# EAGLE design hipwr-tvbnull (EAGLE 5.11)
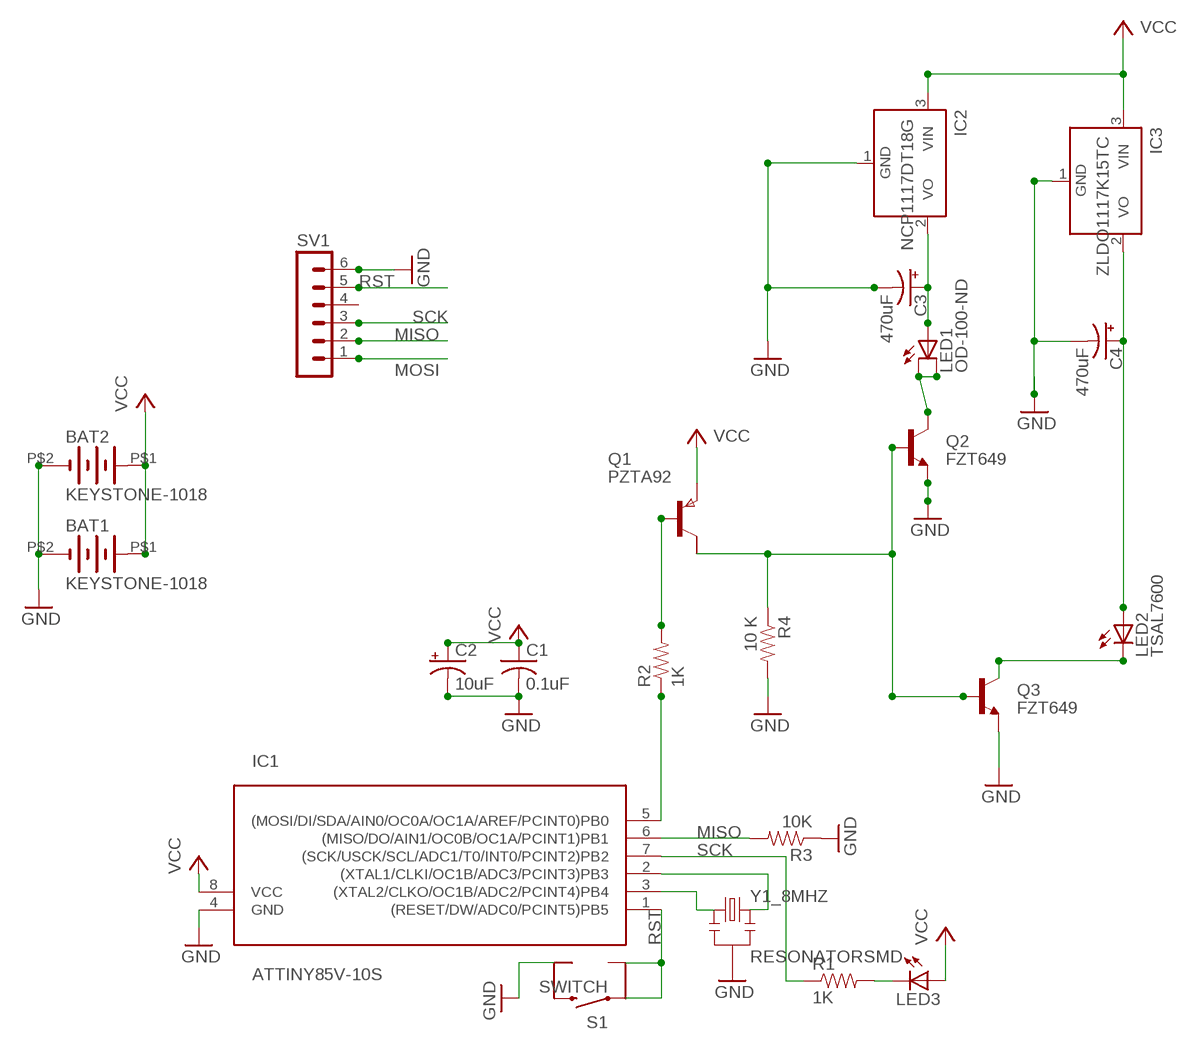
[diagram p0: schematic, sheet 1]

## Parts
BAT1  KEYSTONE-1018  [KEYSTONE-CR123A-SMT]
BAT2  KEYSTONE-1018  [KEYSTONE-CR123A-SMT]
C1  0.1uF  C-USC0805K  [C0805K]
C2  10uF  CAP_POL1206  [EIA3216]
C3  470uF  CAP_POL7343  [EIA7343]
C4  470uF  CAP_POL7343  [EIA7343]
IC1  ATTINY85V-10S  [SOIC8]
IC2  NCP1117DT18G  NCP1117  [TO252-DES]
IC3  ZLDO1117K15TC  NCP1117  [TO252-DES]
LED1  OD-100-ND  OD-100  [OD-100]
LED2  TSAL7600  SFH482  [SFH482]
LED3  LEDCHIPLED_1206  [CHIPLED_1206]
Q1  PZTA92  FZT789A  [SOT223]
Q2  FZT649  TRANSISTOR_NPN  [SOT223]
Q3  FZT649  TRANSISTOR_NPN  [SOT223]
R1  1K  RESISTOR1206  [1206]
R2  1K  RESISTOR1206  [1206]
R3  10K  RESISTOR  [0805]
R4  10 K  RESISTOR  [0805]
S1  SWITCH  SWITCH-MOMENTARY-2SMD  [TACTILE_SWITCH_SMD]
SV1  CON-LSTB_MA06-1  [CON-LSTB_MA06-1]
Y1_8MHZ  RESONATORSMD  [RESONATOR-SMD]

## Nets
GND: BAT1.P$2(-) BAT2.P$2(-) C1.2 C2.C(-) C3.C(-) C4.C(-) IC1.4(GND) IC2.1(GND) IC3.1(GND) Q2.3(E) Q3.3(E) R3.1 R4.2 S1.4 SV1.6 Y1_8MHZ.2
MISO: IC1.6((MISO/DO/AIN1/OC0B/OC1A/PCINT1)PB1) R3.2 SV1.2
MOSI: IC1.5((MOSI/DI/SDA/AIN0/OC0A/OC1A/AREF/PCINT0)PB0) R2.1 SV1.1
N$1: IC1.3((XTAL2/CLKO/OC1B/ADC2/PCINT4)PB4) Y1_8MHZ.1
N$2: IC1.2((XTAL1/CLKI/OC1B/ADC3/PCINT3)PB3) Y1_8MHZ.3
N$3: LED3.C R1.2
N$4: C3.A(+) IC2.2(VO) LED1.ANODE(A)
N$5: LED2.K(C) Q3.2(C)
N$6: Q1.1(B) R2.2
N$7: Q1.4(C1) Q2.1(B) Q3.1(B) R4.1
N$8: LED1.CATHODE2(C1) LED1.CATHODE(C) Q2.2(C)
N$9: C4.A(+) IC3.2(VO) LED2.A
RST: IC1.1((RESET/DW/ADC0/PCINT5)PB5) S1.1 S1.2 SV1.5
SCK: IC1.7((SCK/USCK/SCL/ADC1/T0/INT0/PCINT2)PB2) R1.1 SV1.3
VCC: BAT1.P$1(+) BAT2.P$1(+) C1.1 C2.A(+) IC1.8(VCC) IC2.3(VIN) IC3.3(VIN) LED3.A Q1.3(E)
Unconnected: Q1.2(C) S1.3 SV1.4

## Library data of the parts
BAT1 BAT2 = eagle-library-edeca.net-v4:KEYSTONE-1018
C1 = rcl-ez:C-US: CAPACITOR, American symbol
C2-C4 = SparkFun:CAP_POL: Capacitor Polarized These are standard SMD and PTH capacitors. Normally 10uF, 47uF, and 100uF in electrolytic and tantalum varieties. Always verify the external diameter of the through hole cap, it varies with capacity, voltage, and manufacturer. The EIA devices should be standard.
IC1 = avr:ATTINY85: MICROCONTROLLER 8 Kbytes FLASH 512 bytes EEPROM 512 bytes RAM 4-channel 10 bit ADC USI
IC2 IC3 = national-semiconductor:NCP1117
LED1 = led:OD-100
LED2 = led:SFH482: IR LED infrared emitting diode, Infineon
LED3 = minimidi:LED: LED OSRAM: - CHIPLED LG R971, LG N971, LY N971, LG Q971, LY Q971, LO R971, LY R971 LH N974, LH R974 LS Q976, LO Q976, LY Q976 LO Q996 - Hyper CHIPLED LW Q18S LB Q993, LB Q99A, LB R99A - SideLED LS A670, LO A670, LY A670, LG A670, LP A670 LB A673, LV A673, LT A673, LW A673 LH A674 LY A675 LS A676, LA A676, LO A676, LY A676, LW A676 LS A679, LY A679, LG A679 - Hyper Micro SIDELED® LS Y876, LA Y876, LO Y876, LY Y876 LT Y87S - SmartLED LW L88C, LW L88S LB L89C, LB L89S, LG L890 LS L89K, LO L89K, LY L89K LS L896, LA L896, LO L896, LY L896 - TOPLED LS T670, LO T670, LY T670, LG T670, LP T670 LSG T670, LSP T670, LSY T670, LOP T670, LYG T670 LG T671, LOG T671, LSG T671 LB T673, LV T673, LT T673, LW T673 LH T674 LS T676, LA T676, LO T676, LY T676, LB T676, LH T676, LSB T676, LW T676 LB T67C, LV T67C, LT T67C, LS T67K, LO T67K, LY T67K, LW E67C LS E67B, LA E67B, LO E67B, LY E67B, LB E67C, LV E67C, LT E67C LW T67C LS T679, LY T679, LG T679 LS T770, LO T770, LY T770, LG T770, LP T770 LB T773, LV T773, LT T773, LW T773 LH T774 LS E675, LA E675, LY E675, LS T675 LS T776, LA T776, LO T776, LY T776, LB T776 LHGB T686 LT T68C, LB T68C - Hyper Mini TOPLED® LB M676 - Mini TOPLED Santana® LG M470 LS M47K, LO M47K, LY M47K Source: http://www.osram.convergy.de/
Q1 = zetex:FZT789A: PNP TRANSISTOR; MPN: FZT789A; OC_FARNELL: 9526633; OC_NEWARK: 97K0407
Q2 Q3 = SparkFun:TRANSISTOR_NPN: Transistor NPN BJT configuration in SOT23 package. MMBT2222 is the common NPN we use. Double check BCE configuration again layout.
R1-R4 = SparkFun:RESISTOR: Resistor Basic schematic elements and footprints for 0603, 1206, and PTH 1/10th watt (small) resistors.
S1 = SparkFun:SWITCH-MOMENTARY-2
SV1 = NSL:CON-LSTB_MA06-1: PIN HEADER
Y1_8MHZ = SparkFun:RESONATOR: Resonator Small SMD resonator. This is the itty bitty 10/20MHz resonators with built in caps. CSTCE10M0G55 and CSTCE20M0V53. Footprint has been reviewed closely but hasn't been tested yet.

## Board
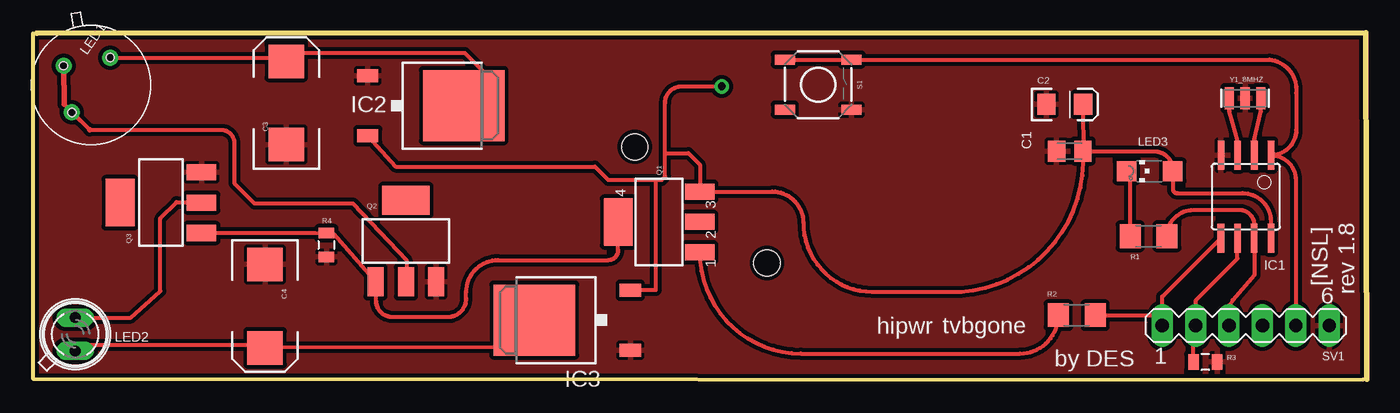
[diagram p1: board, top side]
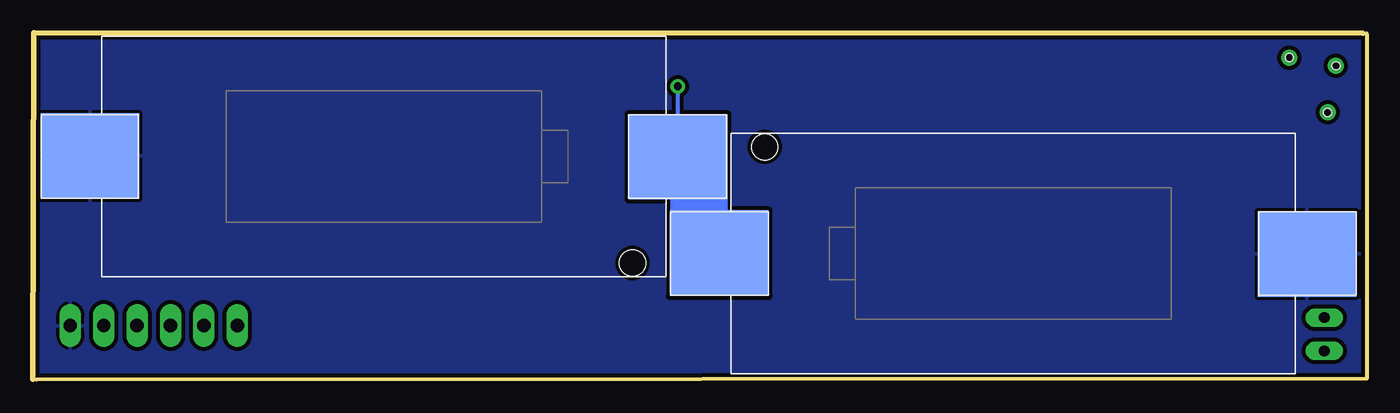
[diagram p2: board, bottom side, seen from below]

Size 101.45 x 26.37 mm. Coordinates in mm from the lower left corner, seen from the top.
Outline: 0.31,26.34 101.4,26.37 101.45,0.03
Outline: 0,26.31 0,0.08 101.17,0
Copper layers (1*16): Top 0.0356mm / dielectric 1.5011mm / Bottom 0.0356mm
Design rules "SparkFun-mod": minimum track width 8mil, minimum drill 20mil, track to track 12mil, track to pad 12mil, pad to pad 8mil, via to via 8mil, smd to smd 8mil, copper to edge 12mil, drill to drill 8mil, minimum pad ring 12mil, minimum via ring 10mil, stop-mask expansion 4mil, vias tented up to drill 25mil, thermal gap 10mil

### Footprints (pad centres in the part's own frame; a part is rotated, then mirrored left to right if it is on the bottom)
KEYSTONE-CR123A-SMT = smd 6.5 x 7.5: P$1 0.02,22.37; P$2 -0.04,-22.34 | hole 2: 8.1,18.915
C0805K = smd 1.3 x 1.6: 1 -1,0; 2 1,0
EIA3216 = smd 1.4 x 1.6: A 1.4,0; C -1.4,0
EIA7343 = smd 2.55 x 2.7: A 3.17,0; C -3.17,0
SOIC8 = smd 0.5 x 2.2: 1 -1.905,-3.154; 2 -0.645,-3.154; 3 0.625,-3.154; 4 1.895,-3.154; 5 1.905,3.154; 6 0.635,3.154; 7 -0.635,3.154; 8 -1.905,3.154
TO252-DES = smd 1 x 1.6: 1 -2.28,-4.8; 3 2.28,-4.8 | smd 5.4 x 6.2: 2 0,2.5
OD-100 = drill 0.61 round: ANODE 0,2.54; CATHODE -2.54,0; CATHODE2 0,-2.54 | hole 0.61: 0,-2.54; -2.54,0; 0,2.54
SFH482 = drill 0.813 long: A -1.27,0; K 1.27,0
CHIPLED_1206 = smd 1.5 x 1.5: A 0,-1.75; C 0,1.75
SOT223 = smd 1.219 x 2.235: 1 -2.311,-3.099; 2 0,-3.099; 3 2.311,-3.099 | smd 3.6 x 2.2: 4 0,3.099
1206 = smd 1.6 x 1.8: 1 -1.4,0; 2 1.4,0
0805 = smd 0.8 x 1.2: 1 -0.9,0; 2 0.9,0
TACTILE_SWITCH_SMD = smd 1.524 x 0.762: 1 -2.54,1.905; 2 2.54,1.905; 3 -2.54,-1.905; 4 2.54,-1.905
CON-LSTB_MA06-1 = drill 1.016 long: 1 -6.35,0; 2 -3.81,0; 3 -1.27,0; 4 1.27,0; 5 3.81,0; 6 6.35,0
RESONATOR-SMD = smd 0.7 x 1.7: 1 -1.2,0; 2 0,0; 3 1.2,0

### Placement (x,y rotation side)
BAT1  74.75,16.97 270 bottom
BAT2  26.87,9.6 90 bottom
C1  78.87,17.37 180 top
C2  78.49,20.93 0 top
C3  19.28,21.03 90 top
C4  17.65,5.59 270 top
IC1  92.26,13.91 180 top
IC2  30.28,20.83 270 top
IC3  40.64,4.52 90 top
LED1  4.42,22.4 325 top
LED2  3.23,3.45 90 top
LED3  84.94,15.85 90 top
Q1  47.62,11.99 90 top
Q2  28.37,10.54 0 top
Q3  9.73,13.46 90 top
R1  84.86,10.9 180 top
R2  79.4,4.9 180 top
R3  89.18,1.35 180 top
R4  22.33,10.24 270 top
S1  59.73,22.43 0 top
SV1  92.25,4.11 0 top
Y1_8MHZ  92.2,21.39 0 top

### Tracks (layer width: path | path; a pad name or v marks a point on that pad's centre or on a via)
GND
  pour Top: 0,2.06 0.03,26.42 101.4,26.34 101.47,-0.03 0.03,0.05
  pour Bottom (isolate 0.305): 0.08,26.37 0.08,-0.05 101.42,-0.05 101.42,26.37
MISO
  Top 0.305: R3.2 88.28,3.95 SV1.2 88.47,4.14 88.47,6.05 91.63,9.2 IC1.6
MOSI
  Top 0.305: IC1.5 85.9,6.3 SV1.1 85.12,4.9 R2.1
N$1
  Top 0.305: IC1.3 91.64,18.12 91.26,19.51 91.01,20.42 Y1_8MHZ.1
N$2
  Top 0.305: IC1.2 arc-90 92.91,16.68 92.91,18.24 93.4,20.38 Y1_8MHZ.3
N$3
  Top 0.305: LED3.C arc-90 83.46,15.27 R1.2
N$4
  Top 0.305: IC2.2 34.42,23.27 32.84,24.84 19.31,24.84 arc90 C3.A 18.39,24.48 LED1.ANODE
N$5
  Top 0.305: 12.8,13.49 10.92,13.49 9.7,12.27 9.7,6.73 7.44,4.72 LED2.K
  Top 0.406: 12.8,13.49 Q3.2
N$6
  Top 0.305: R2.2 arc-90 75.08,1.98 58.42,1.98 arc-90 Q1.1
N$7
  Top 0.305: Q3.1 21.46,11.15 R4.1 | R4.1 22.21,11.09 | R4.1 22.87,11.09 Q2.1 26.09,6.02 arc90 27.33,4.78 31.57,4.78 arc90 32.97,6.17 32.97,6.68 arc-90 35.38,9.09 43.76,9.09 arc90 44.53,9.86 Q1.4
N$8
  Top 0.305: Q2.2 28.42,7.42 28.42,9.09 24.33,13.41 16.84,13.41 15.32,14.94 15.32,17.98 arc90 14.3,19 4.34,19 LED1.CATHODE2 | 4.32,19 2.39,20.93
  Top 0.406: 4.34,19 4.32,19 | 2.39,20.93 LED1.CATHODE
N$9
  Top 0.305: C4.A arc-90 18.17,2.47 38.18,2.5 arc-90 IC3.2 | 3.71,2.64 17.43,2.64
  Top 0.406: 17.43,2.64 C4.A | 3.71,2.64 3,1.93 LED2.A
RST
  Top 0.305: SV1.5 96.06,15.17 arc90 IC1.1 arc90 96.09,18.99 96.09,21.79 arc90 94.06,24.33 S1.2 S1.1
SCK
  Top 0.305: SV1.3 91.01,5.66 91.26,6.05 92.91,7.95 92.91,10.24 IC1.7 92.9,11.78 arc90 91.77,12.9 88.27,12.9 arc90 R1.1
VCC  (via drill 0.6)
  Top 0.305: IC1.8 94.17,12.03 arc90 92.02,14.17 87.04,14.17 arc-90 86.71,14.5 LED3.A arc90 85.42,17.35 C1.1 | C1.1 arc-90 70.6,6.68 63.86,6.68 arc-90 58.6,11.94 arc90 56.24,14.3 Q1.3 50.72,16.36 49.86,17.22 48.08,17.22 | C1.1 arc90 79.94,17.04 C2.A | IC3.3 47.09,6.81 47.37,6.81 47.37,15.19 | 48.08,17.22 48.08,15.44 47.83,15.19 47.37,15.19 | 48.08,17.22 48.08,21.03 arc-90 49.35,22.3 v52.4,22.3 | IC2.3 27.57,16.21 42.75,16.21 43.76,15.19 47.37,15.19
  Bottom 0.305: BAT1.P$1 arc90 52.4,16.97 v52.4,22.3
  Bottom 1.016: BAT2.P$1 52.45,12.83 52.45,15.06 51.41,14.02 51.41,12.29 51.79,12.67 51.79,14.2 50.98,13.39 49.25,13.39 49.12,13.51 | 49.12,13.51 49.12,14.48 | 49.12,13.51 49.12,11.89 52.38,15.15 BAT1.P$1

### Text on the board
_tsilk: [NSL] | rev 1.8 | hipwr | tvbgone | by DES